# EAGLE design umodular_iface8_rev01 (EAGLE 7.2.0)
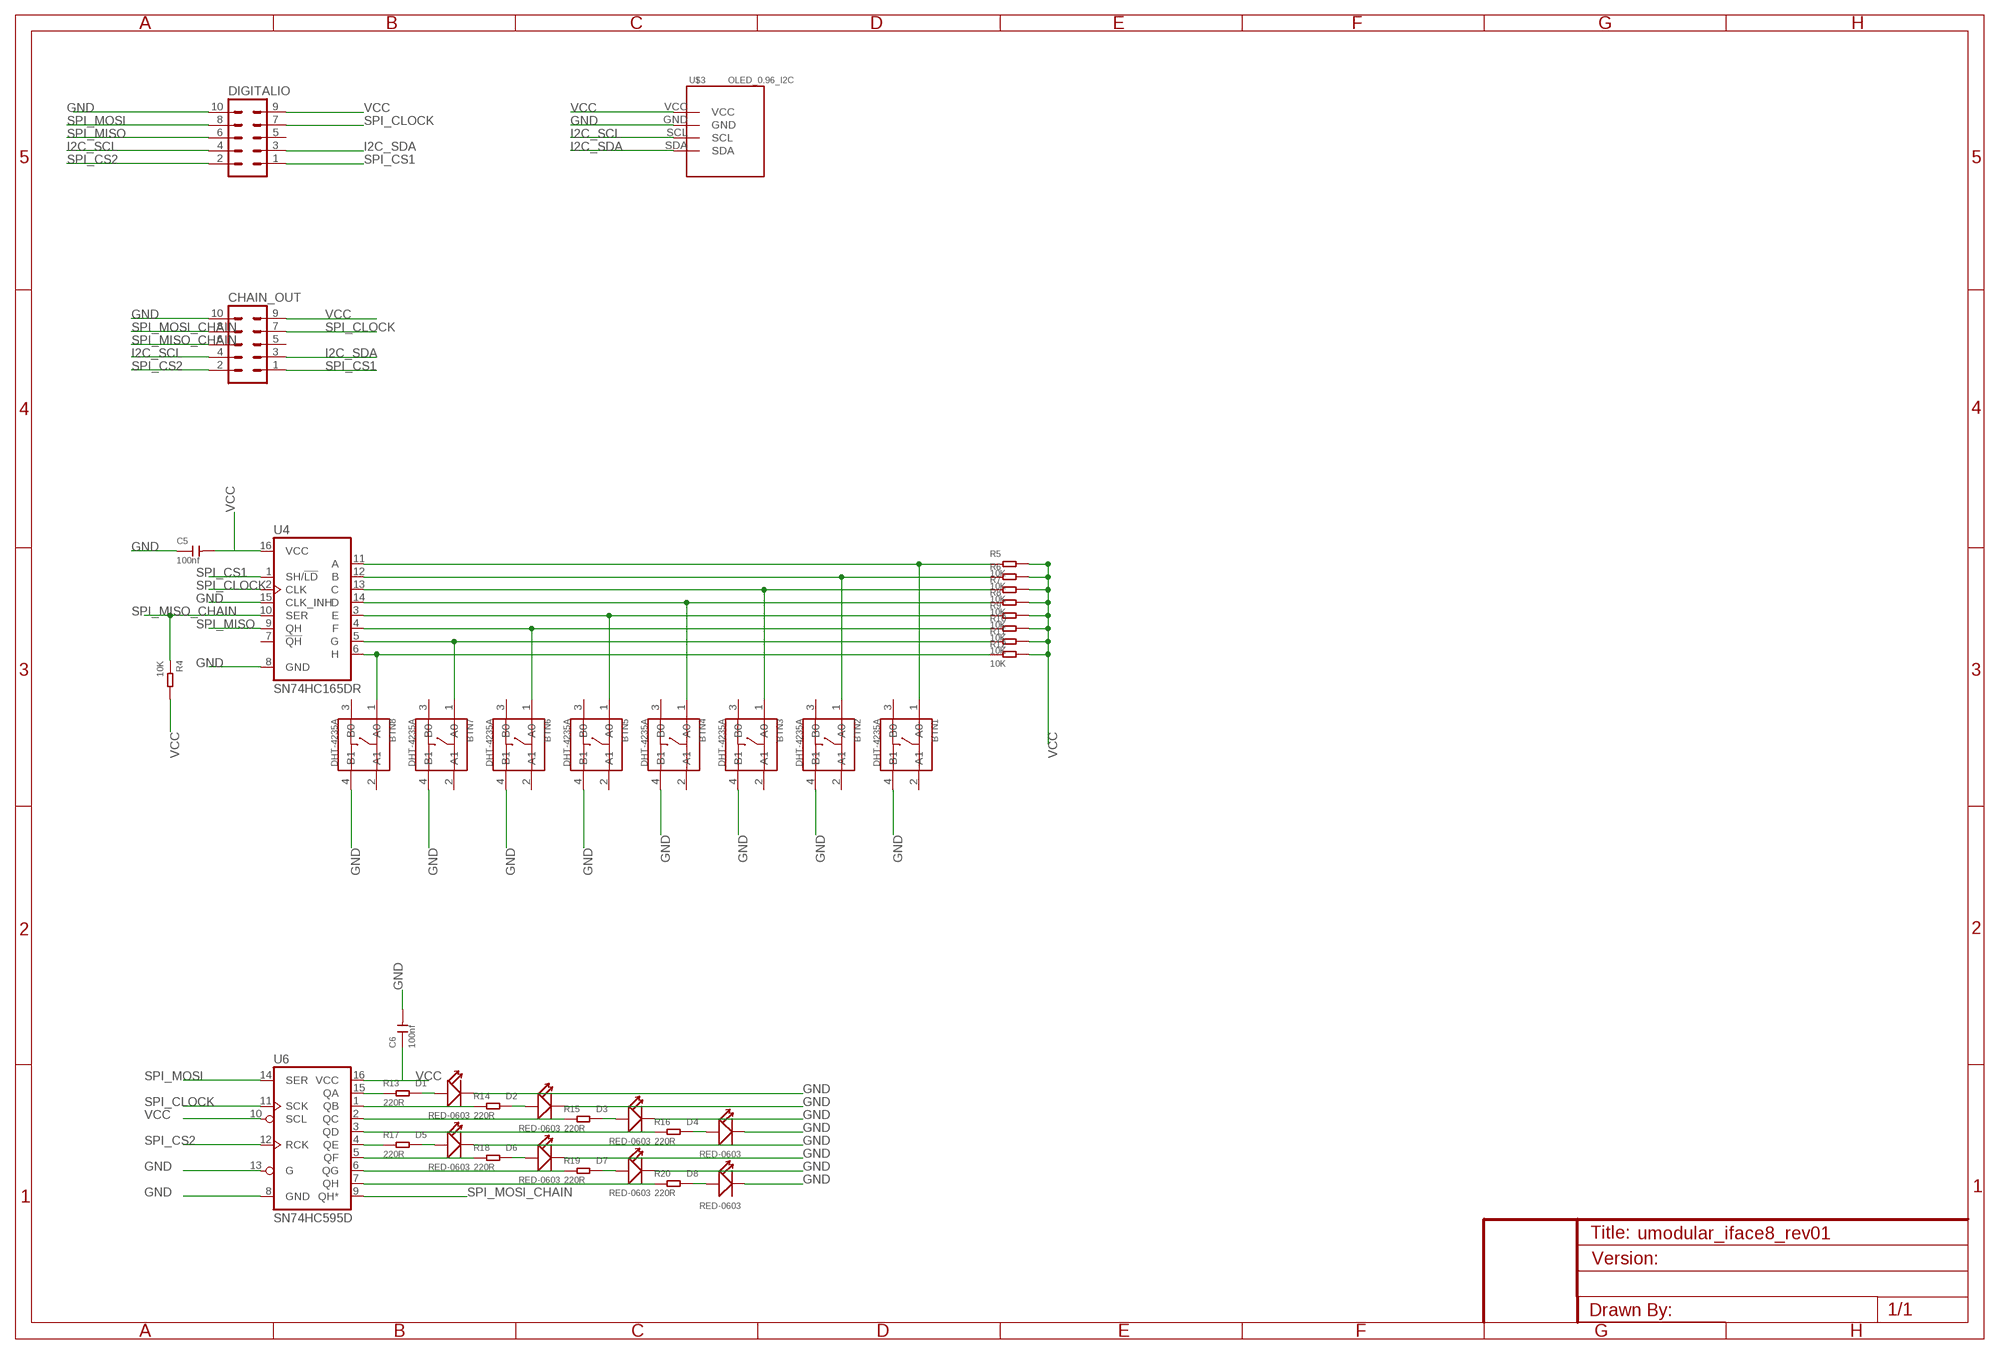
[diagram p0: schematic, sheet 1]

## Parts
BTN1  DHT-4235A  SMD-BUTTON-TOP-DHT-4235A(4P-4.2X3.2MM)  [SW4-SMD-4.2X3.2X2.5MM]
BTN2  DHT-4235A  SMD-BUTTON-TOP-DHT-4235A(4P-4.2X3.2MM)  [SW4-SMD-4.2X3.2X2.5MM]
BTN3  DHT-4235A  SMD-BUTTON-TOP-DHT-4235A(4P-4.2X3.2MM)  [SW4-SMD-4.2X3.2X2.5MM]
BTN4  DHT-4235A  SMD-BUTTON-TOP-DHT-4235A(4P-4.2X3.2MM)  [SW4-SMD-4.2X3.2X2.5MM]
BTN5  DHT-4235A  SMD-BUTTON-TOP-DHT-4235A(4P-4.2X3.2MM)  [SW4-SMD-4.2X3.2X2.5MM]
BTN6  DHT-4235A  SMD-BUTTON-TOP-DHT-4235A(4P-4.2X3.2MM)  [SW4-SMD-4.2X3.2X2.5MM]
BTN7  DHT-4235A  SMD-BUTTON-TOP-DHT-4235A(4P-4.2X3.2MM)  [SW4-SMD-4.2X3.2X2.5MM]
BTN8  DHT-4235A  SMD-BUTTON-TOP-DHT-4235A(4P-4.2X3.2MM)  [SW4-SMD-4.2X3.2X2.5MM]
C5  100nf  CERAMIC-100NF-50V-10%-X7R(0805)  [C0805]
C6  100nf  CERAMIC-100NF-50V-10%-X7R(0805)  [C0805]
CHAIN_OUT  MA05-2  [MA05-2]
D1  RED-0603  LED-SMD-RED-DIFFUSED(0603)  [LED-0603]
D2  RED-0603  LED-SMD-RED-DIFFUSED(0603)  [LED-0603]
D3  RED-0603  LED-SMD-RED-DIFFUSED(0603)  [LED-0603]
D4  RED-0603  LED-SMD-RED-DIFFUSED(0603)  [LED-0603]
D5  RED-0603  LED-SMD-RED-DIFFUSED(0603)  [LED-0603]
D6  RED-0603  LED-SMD-RED-DIFFUSED(0603)  [LED-0603]
D7  RED-0603  LED-SMD-RED-DIFFUSED(0603)  [LED-0603]
D8  RED-0603  LED-SMD-RED-DIFFUSED(0603)  [LED-0603]
DIGITALIO  MA05-2  [MA05-2]
R4  10K  SMD-RES-10K-5%-1/10W(0603)  [R0603]
R5  10K  SMD-RES-10K-5%-1/10W(0603)  [R0603]
R6  10K  SMD-RES-10K-5%-1/10W(0603)  [R0603]
R7  10K  SMD-RES-10K-5%-1/10W(0603)  [R0603]
R8  10K  SMD-RES-10K-5%-1/10W(0603)  [R0603]
R9  10K  SMD-RES-10K-5%-1/10W(0603)  [R0603]
R10  10K  SMD-RES-10K-5%-1/10W(0603)  [R0603]
R11  10K  SMD-RES-10K-5%-1/10W(0603)  [R0603]
R12  10K  SMD-RES-10K-5%-1/10W(0603)  [R0603]
R13  220R  SMD-RES-220R-5%-1/10W(0603)  [R0603]
R14  220R  SMD-RES-220R-5%-1/10W(0603)  [R0603]
R15  220R  SMD-RES-220R-5%-1/10W(0603)  [R0603]
R16  220R  SMD-RES-220R-5%-1/10W(0603)  [R0603]
R17  220R  SMD-RES-220R-5%-1/10W(0603)  [R0603]
R18  220R  SMD-RES-220R-5%-1/10W(0603)  [R0603]
R19  220R  SMD-RES-220R-5%-1/10W(0603)  [R0603]
R20  220R  SMD-RES-220R-5%-1/10W(0603)  [R0603]
U4  SN74HC165DR  74HC165D  [SO16]
U6  SN74HC595D  74HC595D  [SO16]
U$3  OLED_0.96_I2C  [OLED_0.96_I2C]

## Nets
GND: BTN1.4(B1) BTN2.4(B1) BTN3.4(B1) BTN4.4(B1) BTN5.4(B1) BTN6.4(B1) BTN7.4(B1) BTN8.4(B1) C5.1 C6.2 CHAIN_OUT.10 D1.- D2.- D3.- D4.- D5.- D6.- D7.- D8.- DIGITALIO.10 U4.8(GND) U4.15(CLK_INH) U6.8(GND) U6.13(G) U$3.GND
I2C_SCL: CHAIN_OUT.4 DIGITALIO.4 U$3.SCL
I2C_SDA: CHAIN_OUT.3 DIGITALIO.3 U$3.SDA
N$1: BTN8.1(A0) R12.1 U4.6(H)
N$2: R13.1 U6.15(QA)
N$3: R14.1 U6.1(QB)
N$5: R15.1 U6.2(QC)
N$6: R16.1 U6.3(QD)
N$7: R17.1 U6.4(QE)
N$8: R18.1 U6.5(QF)
N$10: BTN7.1(A0) R11.1 U4.5(G)
N$11: BTN6.1(A0) R10.1 U4.4(F)
N$12: BTN5.1(A0) R9.1 U4.3(E)
N$13: BTN4.1(A0) R8.1 U4.14(D)
N$14: BTN3.1(A0) R7.1 U4.13(C)
N$15: BTN2.1(A0) R6.1 U4.12(B)
N$16: BTN1.1(A0) R5.1 U4.11(A)
N$17: R19.1 U6.6(QG)
N$18: R20.1 U6.7(QH)
N$19: D1.+ R13.2
N$20: D2.+ R14.2
N$21: D3.+ R15.2
N$22: D4.+ R16.2
N$23: D5.+ R17.2
N$24: D6.+ R18.2
N$25: D7.+ R19.2
N$26: D8.+ R20.2
SPI_CLOCK: CHAIN_OUT.7 DIGITALIO.7 U4.2(CLK) U6.11(SCK)
SPI_CS1: CHAIN_OUT.1 DIGITALIO.1 U4.1(SH/!LD)
SPI_CS2: CHAIN_OUT.2 DIGITALIO.2 U6.12(RCK)
SPI_MISO: DIGITALIO.6 U4.9(QH)
SPI_MISO_CHAIN: CHAIN_OUT.6 R4.1 U4.10(SER)
SPI_MOSI: DIGITALIO.8 U6.14(SER)
SPI_MOSI_CHAIN: CHAIN_OUT.8 U6.9(QH*)
VCC: C5.2 C6.1 CHAIN_OUT.9 DIGITALIO.9 R4.2 R5.2 R6.2 R7.2 R8.2 R9.2 R10.2 R11.2 R12.2 U4.16(VCC) U6.10(SCL) U6.16(VCC) U$3.VCC
Unconnected: BTN1.2(A1) BTN1.3(B0) BTN2.2(A1) BTN2.3(B0) BTN3.2(A1) BTN3.3(B0) BTN4.2(A1) BTN4.3(B0) BTN5.2(A1) BTN5.3(B0) BTN6.2(A1) BTN6.3(B0) BTN7.2(A1) BTN7.3(B0) BTN8.2(A1) BTN8.3(B0) CHAIN_OUT.5 DIGITALIO.5 U4.7(!QH)

## Library data of the parts
BTN1-BTN8 = Seeed-Switch-2016:SMD-BUTTON-TOP-DHT-4235A(4P-4.2X3.2MM): 311020045; MPN: DHT-4235A
C5 C6 = Seeed-Capacitor-2016:CERAMIC-100NF-50V-10%-X7R(0805): 302010165; MPN: CC0805KRX7R9BB104
CHAIN_OUT DIGITALIO = con-lstb:MA05-2: PIN HEADER; OC_FARNELL: unknown; OC_NEWARK: unknown
D1-D8 = Seeed-LED-2016:LED-SMD-RED-DIFFUSED(0603): 304090042; MPN: 19-217-R6C-AL1M2VY-3T
R4-R12 = Seeed-Resistor-2016:SMD-RES-10K-5%-1/10W(0603): 301010293; MPN: RC0603JR-0710KL; VALUE: 10K 1/10W
R13-R20 = Seeed-Resistor-2016:SMD-RES-220R-5%-1/10W(0603): 301010163; MPN: RC0603JR-07220RL
U4 = SparkFun-IC-Logic:74*165: 8-Bit Shift Register (Parallel to Serial) Datasheet <https://cdn.sparkfun.com/datasheets/BreakoutBoards/sn54hc165.pdf> SparkFun Products SparkFun Shift-In Breakout - SN74HC165 <https://www.sparkfun.com/products/11733> (BOB-11733); PROD_ID: IC-11325
U6 = SparkFun-IC-Logic:74*595: 8-Bit Shift Register (Serial to Parallel) Datasheet <http://cdn.sparkfun.com/datasheets/BreakoutBoards/MM74HC595.pdf> SparkFun Products SparkFun Shift Register Breakout - 74HC595 <https://www.sparkfun.com/products/10680> (BOB-10680); PROD_ID: IC-07875
U$3 = tft_1.8_1.44_oled_0.96-mod:OLED_0.96_I2C

## Board
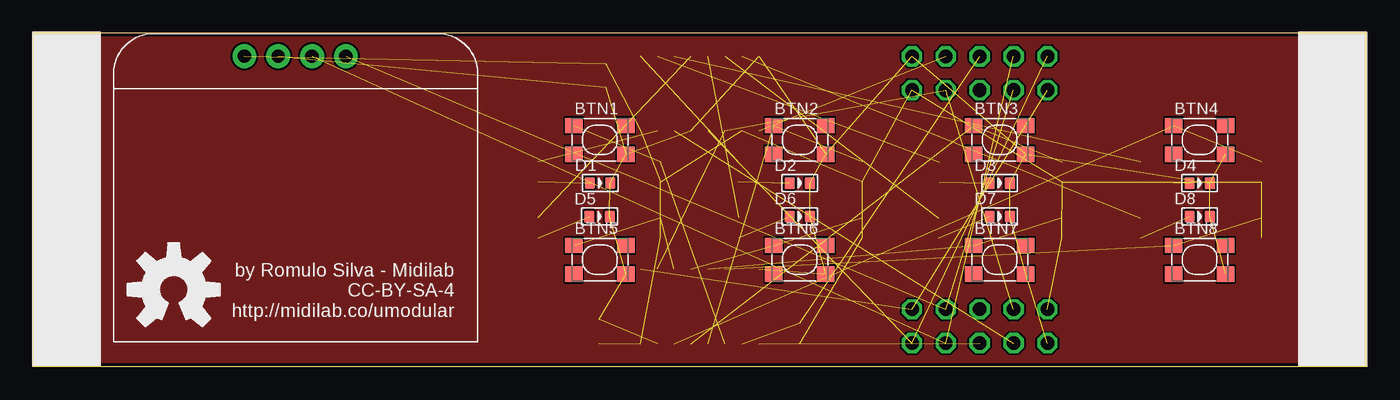
[diagram p1: board, top side]
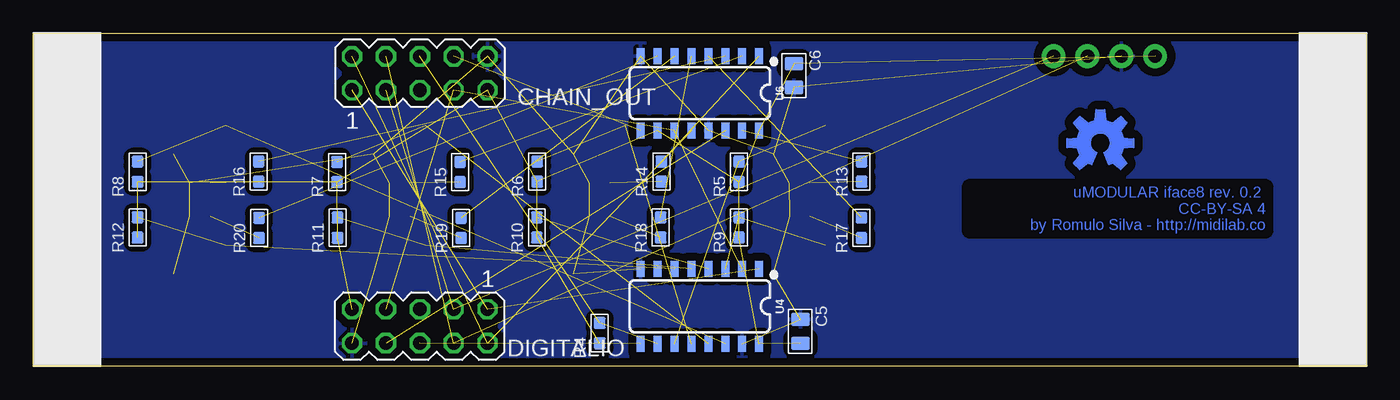
[diagram p2: board, bottom side, seen from below]

Size 100 x 25 mm. Coordinates in mm from the lower left corner, seen from the top.
Outline: 0,0 100,0 100,25 0,25 0,0
Copper layers (1*16): Top 0.035mm / dielectric 1.5mm / Bottom 0.035mm
Design rules "SeeedStudio_2layer_DRU_no_angle_20140221": minimum track width 6mil, minimum drill 12mil, track to track 6mil, track to pad 6mil, pad to pad 6mil, via to via 6mil, smd to smd 0mil, copper to edge 10mil, drill to drill 10mil, minimum pad ring 10mil, minimum via ring 6mil, stop-mask expansion 2mil, vias tented up to drill 100mil, thermal gap 10mil

### Footprints (pad centres in the part's own frame; a part is rotated, then mirrored left to right if it is on the bottom)
SW4-SMD-4.2X3.2X2.5MM = smd 1.3 x 1.15: 1 -1.95,1.075; 2 1.95,1.075; 3 -1.95,-1.075; 4 1.95,-1.075
C0805 = smd 1.397 x 1.016: 1 0,0.889; 2 0,-0.889
MA05-2 = drill 1.016 octagon: 1 -5.08,-1.27; 2 -5.08,1.27; 3 -2.54,-1.27; 4 -2.54,1.27; 5 0,-1.27; 6 0,1.27; 7 2.54,-1.27; 8 2.54,1.27; 9 5.08,-1.27; 10 5.08,1.27
LED-0603 = smd 0.762 x 0.889: + -0.762,0; - 0.762,0
R0603 = smd 0.889 x 0.889: 1 0,0.762; 2 0,-0.762
SO16 = smd 0.6 x 1.2: 1 -4.445,-2.8; 2 -3.175,-2.8; 3 -1.905,-2.8; 4 -0.635,-2.8; 5 0.635,-2.8; 6 1.905,-2.8; 7 3.175,-2.8; 8 4.445,-2.8; 9 4.445,2.8; 10 3.175,2.8; 11 1.905,2.8; 12 0.635,2.8; 13 -0.635,2.8; 14 -1.905,2.8; 15 -3.175,2.8; 16 -4.445,2.8
OLED_0.96_I2C = hole 2.8: 2.5,6.25; 2.5,18.75
OLED_0.96_I2C' = drill 1 pad 1.778: GND -1.63,11.63; SCL 0.91,11.63; SDA 3.45,11.63; VCC -4.17,11.63

### Placement (x,y rotation side)
BTN1  42.5,17 0 top
BTN2  57.5,17 0 top
BTN3  72.5,17 0 top
BTN4  87.5,17 0 top
BTN5  42.5,8 0 top
BTN6  57.5,8 0 top
BTN7  72.5,8 0 top
BTN8  87.5,8 0 top
C5  42.45,2.62 0 bottom
C6  42.93,21.83 0 bottom
CHAIN_OUT  71,22 0 bottom
D1  42.52,13.76 0 top
D2  57.5,13.75 0 top
D3  72.5,13.75 0 top
D4  87.5,13.75 0 top
D5  42.48,11.23 0 top
D6  57.5,11.25 0 top
D7  72.5,11.25 0 top
D8  87.5,11.25 0 top
DIGITALIO  71,3 180 bottom
R4  57.51,2.49 0 bottom
R5  47.05,14.6 0 bottom
R6  62.19,14.62 0 bottom
R7  77.21,14.58 0 bottom
R8  92.17,14.61 0 bottom
R9  47.05,10.42 0 bottom
R10  62.22,10.42 0 bottom
R11  77.17,10.4 0 bottom
R12  92.17,10.42 0 bottom
R13  37.86,14.62 0 bottom
R14  52.88,14.62 0 bottom
R15  67.98,14.58 0 bottom
R16  83.09,14.62 0 bottom
R17  37.87,10.39 0 bottom
R18  52.93,10.42 0 bottom
R19  67.9,10.38 0 bottom
R20  83.06,10.38 0 bottom
U4  49.99,4.49 180 bottom
U6  49.99,20.5 180 bottom
U$1  [OSHW-LOGO-M]  19.95,16.76 0 top
U$2  [OLED_0.96_I2C]  0,0 0 top
U$3  OLED_0.96_I2C  [OLED_0.96_I2C']  20,11.65 0 top
U$4  [OLED_0.96_I2C]  95,0 0 top
U$5  [OSHW-LOGO-L]  10.54,5.75 0 top

### Tracks (layer width: path | path; a pad name or v marks a point on that pad's centre or on a via)
AGND
  pour Top: 100.15,25.17 100.25,0.05 -0.14,-0.24 0.03,25.14
GND  (24 unrouted)
  pour Bottom (isolate 0.61): -0.07,25.25 100.29,25.3 100.12,-0.2 0,-0.12
I2C_SCL  (2 unrouted)
I2C_SDA  (2 unrouted)
N$1  (2 unrouted)
N$2  (1 unrouted)
N$3  (1 unrouted)
N$5  (1 unrouted)
N$6  (1 unrouted)
N$7  (1 unrouted)
N$8  (1 unrouted)
N$10  (2 unrouted)
N$11  (2 unrouted)
N$12  (2 unrouted)
N$13  (2 unrouted)
N$14  (2 unrouted)
N$15  (2 unrouted)
N$16  (2 unrouted)
N$17  (1 unrouted)
N$18  (1 unrouted)
N$19  (1 unrouted)
N$20  (1 unrouted)
N$21  (1 unrouted)
N$22  (1 unrouted)
N$23  (1 unrouted)
N$24  (1 unrouted)
N$25  (1 unrouted)
N$26  (1 unrouted)
SPI_CLOCK  (3 unrouted)
SPI_CS1  (2 unrouted)
SPI_CS2  (2 unrouted)
SPI_MISO  (1 unrouted)
SPI_MISO_CHAIN  (2 unrouted)
SPI_MOSI  (1 unrouted)
SPI_MOSI_CHAIN  (1 unrouted)
VCC  (16 unrouted)

### Text on the board
Bottom: testing | uMODULAR iface8 rev. 0.2 / CC-BY-SA 4 / by Romulo Silva - http://midilab.co
tNames: by Romulo Silva - Midilab / CC-BY-SA-4 / http://midilab.co/umodular